# EAGLE board 8700 orig 45deg (EAGLE 7.4.0)
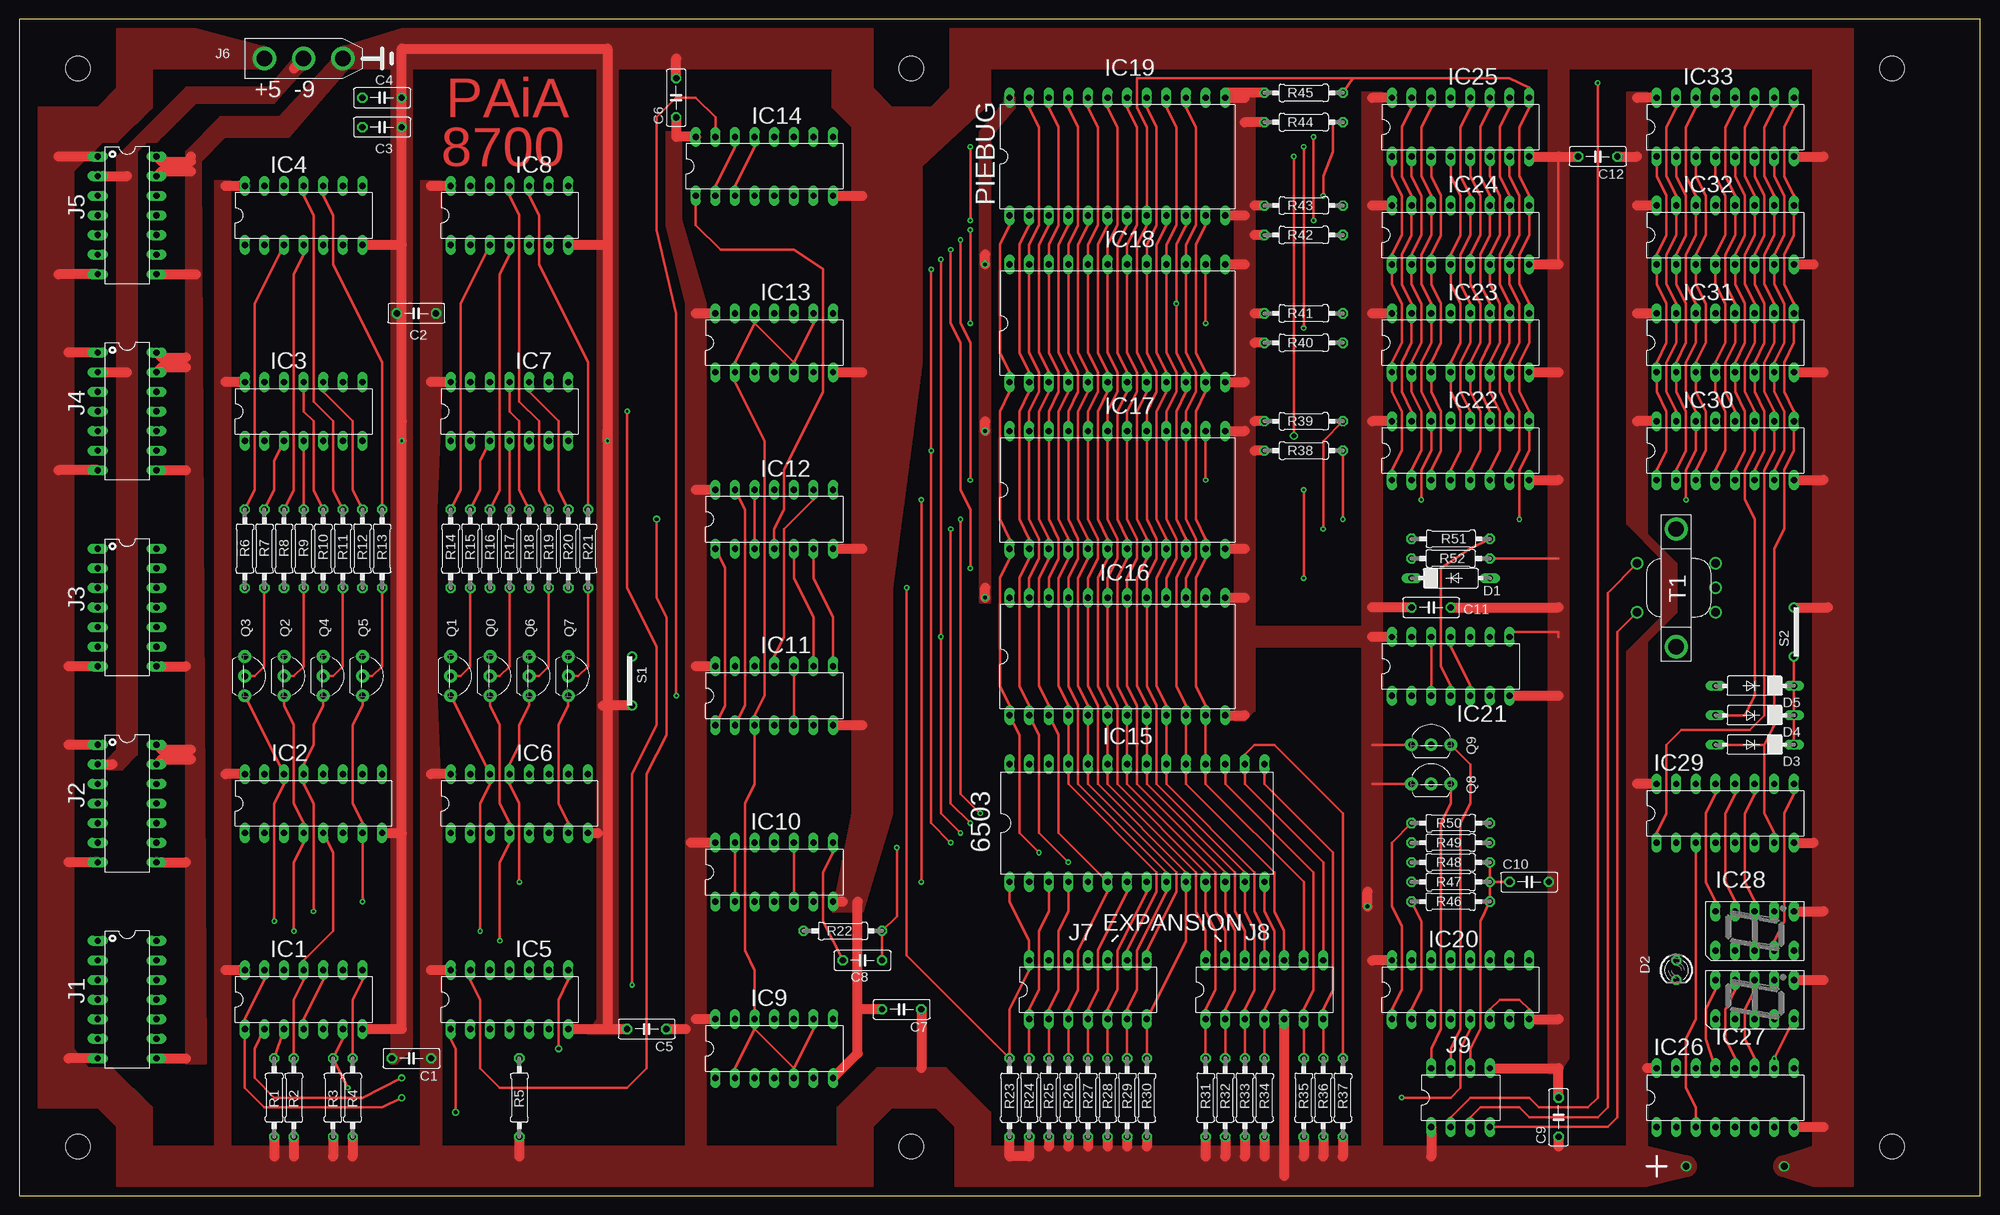
[diagram p2: board, top side]
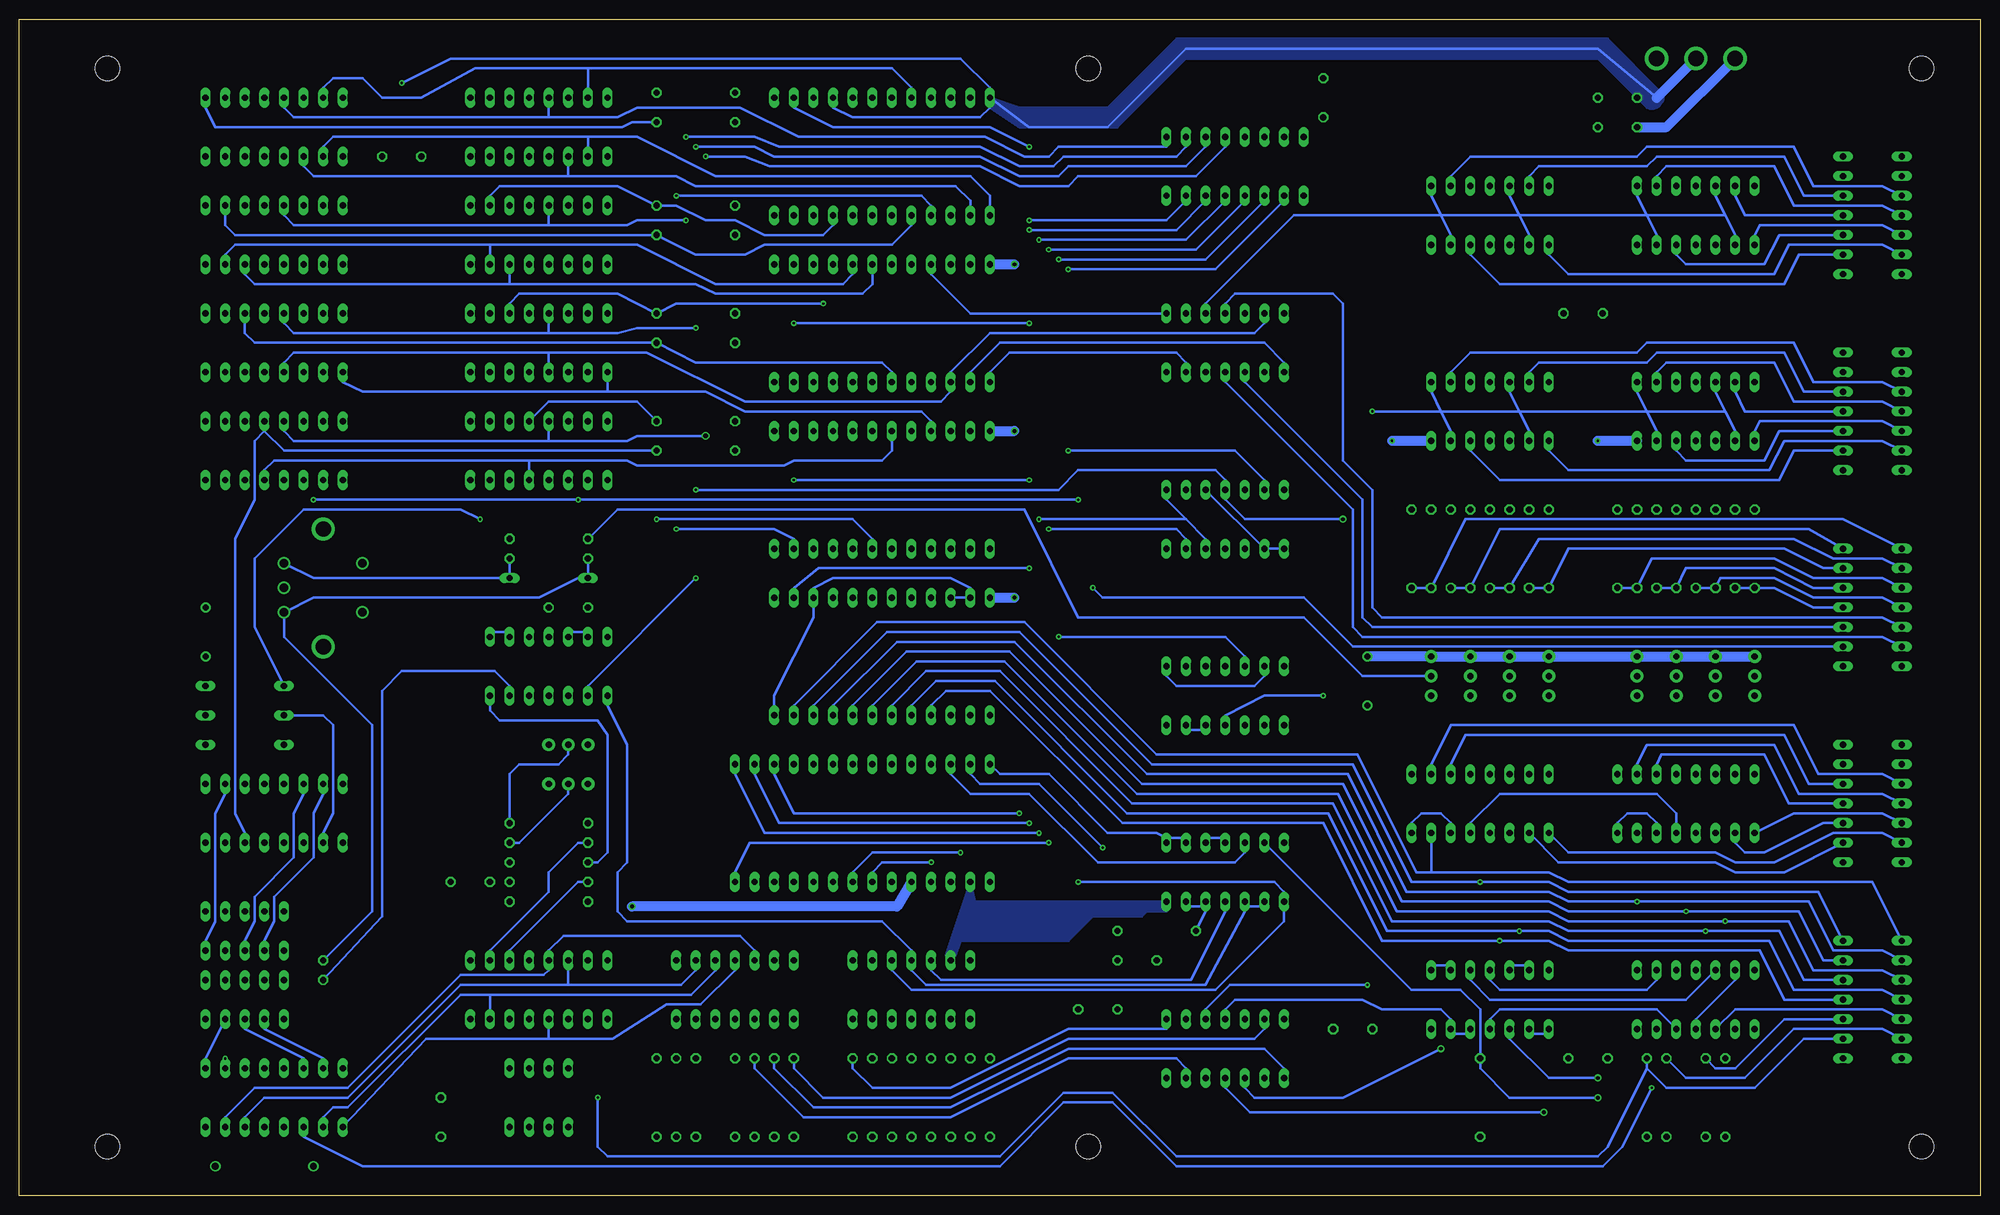
[diagram p3: board, bottom side, seen from below]

Size 254 x 152.4 mm. Coordinates in mm from the lower left corner, seen from the top.
Outline: 0,0 253.98,0 254,152.4 0,152.4 0,0
Copper layers (1*16): Top 0.035mm / dielectric 1.5mm / Bottom 0.035mm
Design rules "default": minimum track width 10mil, minimum drill 24mil, track to track 8mil, track to pad 8mil, pad to pad 8mil, via to via 8mil, smd to smd 8mil, copper to edge 40mil, drill to drill 8mil, minimum pad ring 10mil, minimum via ring 8mil, stop-mask expansion 4mil, vias tented up to drill 0mil, thermal gap 10mil
Holes 3.2 mm at 115.57,6.35 242.57,146.05 242.57,6.35 7.62,6.35 7.62,146.05 115.57,146.05

## Footprints (pad centres in the part's own frame; a part is rotated, then mirrored left to right if it is on the bottom)
C050-025X075 = drill 0.813 octagon: 1 -2.54,0; 2 2.54,0
DO07 = drill 0.813 long: A 5.08,0; C -5.08,0
LED3MM = drill 0.813 octagon: A -1.27,0; K 1.27,0
DIL14 = drill 0.813 long: 1 -7.62,-3.81; 2 -5.08,-3.81; 3 -2.54,-3.81; 4 0,-3.81; 5 2.54,-3.81; 6 5.08,-3.81; 7 7.62,-3.81; 8 7.62,3.81; 9 5.08,3.81; 10 2.54,3.81; 11 0,3.81; 12 -2.54,3.81; 13 -5.08,3.81; 14 -7.62,3.81
DIL16 = drill 0.813 long: 1 -8.89,-3.81; 2 -6.35,-3.81; 3 -3.81,-3.81; 4 -1.27,-3.81; 5 1.27,-3.81; 6 3.81,-3.81; 7 6.35,-3.81; 8 8.89,-3.81; 9 8.89,3.81; 10 6.35,3.81; 11 3.81,3.81; 12 1.27,3.81; 13 -1.27,3.81; 14 -3.81,3.81; 15 -6.35,3.81; 16 -8.89,3.81
DIL28-6 = drill 0.813 long: 1 -16.51,-7.62; 2 -13.97,-7.62; 3 -11.43,-7.62; 4 -8.89,-7.62; 5 -6.35,-7.62; 6 -3.81,-7.62; 7 -1.27,-7.62; 8 1.27,-7.62; 9 3.81,-7.62; 10 6.35,-7.62; 11 8.89,-7.62; 12 11.43,-7.62; 13 13.97,-7.62; 14 16.51,-7.62; 15 16.51,7.62; 16 13.97,7.62; 17 11.43,7.62; 18 8.89,7.62; 19 6.35,7.62; 20 3.81,7.62; 21 1.27,7.62; 22 -1.27,7.62; 23 -3.81,7.62; 24 -6.35,7.62; 25 -8.89,7.62; 26 -11.43,7.62; 27 -13.97,7.62; 28 -16.51,7.62
DIL24 = drill 0.813 long: 1 -13.97,-7.62; 2 -11.43,-7.62; 3 -8.89,-7.62; 4 -6.35,-7.62; 5 -3.81,-7.62; 6 -1.27,-7.62; 7 1.27,-7.62; 8 3.81,-7.62; 9 6.35,-7.62; 10 8.89,-7.62; 11 11.43,-7.62; 12 13.97,-7.62; 13 13.97,7.62; 14 11.43,7.62; 15 8.89,7.62; 16 6.35,7.62; 17 3.81,7.62; 18 1.27,7.62; 19 -1.27,7.62; 20 -3.81,7.62; 21 -6.35,7.62; 22 -8.89,7.62; 23 -11.43,7.62; 24 -13.97,7.62
HDSP-A = drill 0.813 long: 1 -2.54,5.08; 2 -2.54,2.54; 3 -2.54,0; 4 -2.54,-2.54; 5 -2.54,-5.08; 6 2.54,-5.08; 7 2.54,-2.54; 8 2.54,0; 9 2.54,2.54; 10 2.54,5.08
POWER = drill 2: P$1 -5.08,0; P$2 0,0; P$3 5.08,0
DIL08 = drill 0.813 long: 1 -3.81,-3.81; 2 -1.27,-3.81; 3 1.27,-3.81; 4 3.81,-3.81; 5 3.81,3.81; 6 1.27,3.81; 7 -1.27,3.81; 8 -3.81,3.81
TO92-EBC = drill 0.813 pad 1.676: B 0,-1.27; C 2.54,-1.27; E -2.54,-1.27
0207/10 = drill 0.813 octagon: 1 -5.08,0; 2 5.08,0
JUMPER = drill 0.8: 1 -3.175,0; 2 3.175,0
TRANSF = drill 1.1: P$1 -5.08,3.175; P$2 -5.08,-3.175; P$3 5.08,-3.175; P$4 5.08,0; P$5 5.08,3.175 | drill 2: P$6 0,7.62; P$7 0,-7.62

## Placement (x,y rotation side)
C1  [C050-025X075]  50.8,17.78 180 top
C2  [C050-025X075]  51.44,114.3 180 top
C3  [C050-025X075]  46.99,138.43 0 top
C4  [C050-025X075]  46.99,142.24 0 top
C5  [C050-025X075]  81.28,21.59 180 top
C6  [C050-025X075]  85.09,142.24 90 top
C7  [C050-025X075]  114.3,24.13 180 top
C8  33pf  [C050-025X075]  109.22,30.48 0 top
C9  [C050-025X075]  199.39,10.16 90 top
C10  [C050-025X075]  195.58,40.64 0 top
C11  [C050-025X075]  182.88,76.2 0 top
C12  [C050-025X075]  204.47,134.62 180 top
D1  [DO07]  185.42,80.01 0 top
D2  [LED3MM]  214.63,29.21 270 top
D3  1N914  [DO07]  224.79,58.42 180 top
D4  1N914  [DO07]  224.79,62.23 180 top
D5  1N914  [DO07]  224.79,66.04 180 top
IC1  74LS00  [DIL14]  36.83,25.4 0 top
IC2  4042  [DIL16]  38.1,50.8 0 top
IC3  4001  [DIL14]  36.83,101.6 0 top
IC4  4001  [DIL14]  36.83,127 0 top
IC5  4011  [DIL14]  63.5,25.4 0 top
IC6  4042  [DIL16]  64.77,50.8 0 top
IC7  4001  [DIL14]  63.5,101.6 0 top
IC8  4001  [DIL14]  63.5,127 0 top
IC9  4011  [DIL14]  97.79,19.05 0 top
IC10  74LS02  [DIL14]  97.79,41.91 0 top
IC11  4001  [DIL14]  97.79,64.77 0 top
IC12  4011  [DIL14]  97.79,87.63 0 top
IC13  4011  [DIL14]  97.79,110.49 0 top
IC14  4556  [DIL16]  96.52,133.35 0 top
IC15  6503  [DIL28-6]  144.78,48.26 0 top
IC16  1702  [DIL24]  142.24,69.85 0 top
IC17  1702  [DIL24]  142.24,91.44 0 top
IC18  1702  [DIL24]  142.24,113.03 0 top
IC19  1702  [DIL24]  142.24,134.62 0 top
IC20  4042  [DIL16]  186.69,26.67 0 top
IC21  4001  [DIL14]  185.42,68.58 0 top
IC22  2112  [DIL16]  186.69,96.52 0 top
IC23  2112  [DIL16]  186.69,110.49 0 top
IC24  2112  [DIL16]  186.69,124.46 0 top
IC25  2112  [DIL16]  186.69,138.43 0 top
IC26  9368  [DIL16]  220.98,12.7 0 top
IC27  HD-A101  [HDSP-A]  224.79,25.4 90 top
IC28  HD-A101  [HDSP-A]  224.79,34.29 90 top
IC29  9368  [DIL16]  220.98,49.53 0 top
IC30  2112  [DIL16]  220.98,96.52 0 top
IC31  2112  [DIL16]  220.98,110.49 0 top
IC32  2112  [DIL16]  220.98,124.46 0 top
IC33  2112  [DIL16]  220.98,138.43 0 top
J1  DATA BUS  [DIL14]  13.97,25.4 270 top
J2  OUTPUT  [DIL14]  13.97,50.8 270 top
J3  KEYBOARD  [DIL14]  13.97,76.2 270 top
J4  INPUT 1  [DIL14]  13.97,101.6 270 top
J5  INPUT 2  [DIL14]  13.97,127 270 top
J6  POWER  [POWER]  36.83,147.32 0 top
J7  EXPANSION0  [DIL14]  138.43,26.67 0 top
J8  EXPANSION1  [DIL14]  161.29,26.67 0 top
J9  Cassette  [DIL08]  186.69,12.7 0 top
Q0  [TO92-EBC]  62.23,67.31 270 top
Q1  [TO92-EBC]  57.15,67.31 270 top
Q2  [TO92-EBC]  35.56,67.31 270 top
Q3  [TO92-EBC]  30.48,67.31 270 top
Q4  [TO92-EBC]  40.64,67.31 270 top
Q5  [TO92-EBC]  45.72,67.31 270 top
Q6  [TO92-EBC]  67.31,67.31 270 top
Q7  [TO92-EBC]  72.39,67.31 270 top
Q8  [TO92-EBC]  182.88,54.61 0 top
Q9  [TO92-EBC]  182.88,59.69 0 top
R1  3.3k  [0207/10]  33.02,12.7 90 top
R2  3.3k  [0207/10]  35.56,12.7 90 top
R3  3.3k  [0207/10]  40.64,12.7 90 top
R4  3.3k  [0207/10]  43.18,12.7 90 top
R5  3.3k  [0207/10]  64.77,12.7 90 top
R6  27K  [0207/10]  29.21,83.82 270 top
R7  27K  [0207/10]  31.75,83.82 270 top
R8  27K  [0207/10]  34.29,83.82 270 top
R9  27K  [0207/10]  36.83,83.82 270 top
R10  27K  [0207/10]  39.37,83.82 270 top
R11  27K  [0207/10]  41.91,83.82 270 top
R12  27K  [0207/10]  44.45,83.82 270 top
R13  27K  [0207/10]  46.99,83.82 270 top
R14  27K  [0207/10]  55.88,83.82 270 top
R15  27K  [0207/10]  58.42,83.82 270 top
R16  27K  [0207/10]  60.96,83.82 270 top
R17  27K  [0207/10]  63.5,83.82 270 top
R18  27K  [0207/10]  66.04,83.82 270 top
R19  27K  [0207/10]  68.58,83.82 270 top
R20  27K  [0207/10]  71.12,83.82 270 top
R21  27K  [0207/10]  73.66,83.82 270 top
R22  2k  [0207/10]  106.68,34.29 180 top
R23  27k  [0207/10]  128.27,12.7 270 top
R24  27k  [0207/10]  130.81,12.7 270 top
R25  27k  [0207/10]  133.35,12.7 270 top
R26  10k  [0207/10]  135.89,12.7 270 top
R27  10k  [0207/10]  138.43,12.7 270 top
R28  10k  [0207/10]  140.97,12.7 270 top
R29  10k  [0207/10]  143.51,12.7 270 top
R30  10k  [0207/10]  146.05,12.7 270 top
R31  10k  [0207/10]  153.67,12.7 270 top
R32  10k  [0207/10]  156.21,12.7 270 top
R33  10k  [0207/10]  158.75,12.7 270 top
R34  10k  [0207/10]  161.29,12.7 270 top
R35  10k  [0207/10]  166.37,12.7 270 top
R36  10k  [0207/10]  168.91,12.7 270 top
R37  10k  [0207/10]  171.45,12.7 270 top
R38  10k  [0207/10]  166.37,96.52 180 top
R39  10k  [0207/10]  166.37,100.33 180 top
R40  10k  [0207/10]  166.37,110.49 180 top
R41  10k  [0207/10]  166.37,114.3 180 top
R42  10k  [0207/10]  166.37,124.46 180 top
R43  10k  [0207/10]  166.37,128.27 180 top
R44  10k  [0207/10]  166.37,139.06 180 top
R45  10k  [0207/10]  166.37,142.88 180 top
R46  100k  [0207/10]  185.42,38.1 0 top
R47  100k  [0207/10]  185.42,40.64 0 top
R48  1k  [0207/10]  185.42,43.18 0 top
R49  10k  [0207/10]  185.42,45.72 0 top
R50  10k  [0207/10]  185.42,48.26 0 top
R51  1k  [0207/10]  185.42,82.55 0 top
R52  27k  [0207/10]  185.42,85.09 180 top
S1  [JUMPER]  79.38,66.67 270 top
S2  [JUMPER]  229.87,73.03 90 top
T1  [TRANSF]  214.63,78.74 0 top

## Tracks (layer width: path | path; a pad name or v marks a point on that pad's centre or on a via)
+5V  (via drill 0.5, 0.9 pad 0.3)
  Top 0.305: IC19.15 151.13,140.97 152.4,138.43 152.4,125.73 151.13,123.19 IC18.15 151.13,109.22 152.4,106.68 152.4,104.14 151.13,101.6 IC17.15 151.13,87.63 152.4,85.09 152.4,82.55 151.13,80.01 IC16.15 | IC19.23 130.81,140.97 132.08,138.43 132.08,125.73 130.81,123.19 IC18.23 130.81,109.22 132.08,106.68 132.08,104.14 130.81,101.6 IC17.23 130.81,87.63 132.08,85.09 132.08,82.55 130.81,80.01 IC16.23 | IC19.22 133.35,140.97 134.62,138.43 134.62,125.73 133.35,123.19 IC18.22 133.35,109.22 134.62,106.68 134.62,104.14 133.35,101.6 IC17.22 133.35,87.63 134.62,85.09 134.62,82.55 133.35,80.01 IC16.22 | Q9.E 175.26,58.42 | Q8.E 175.26,53.34
  Top 1.27: IC4.14 26.67,130.81 | IC3.14 26.67,105.41 | IC2.16 26.67,54.61 | IC1.14 26.67,29.21 | IC8.14 53.34,130.81 | IC7.14 53.34,105.41 | IC6.16 53.34,54.61 | IC5.14 53.34,29.21 | IC9.14 87.63,22.86 | IC11.14 87.63,68.58 | IC12.14 87.63,91.44 | IC13.14 87.63,114.3 | IC10.14 87,45.72 | R1.1 33.02,5.08 | R2.1 35.56,5.08 | R3.1 40.64,5.08 | R4.1 43.18,5.08 | J1.7 6.35,17.78 | J2.7 6.35,43.18 | J2.1 6.35,58.42 | J3.7 6.35,68.58 | J5.1 5.08,134.62 | J4.7 5.08,93.98 | IC14.16 85.09,137.16 C6.1 | IC21.14 175.26,72.39 | IC17.12 158.75,83.82 | IC16.12 158.75,62.23 | IC18.12 158.75,105.41 | IC19.12 158.75,127 | IC22.16 175.26,100.33 | IC23.16 175.26,114.3 | IC24.16 175.26,128.27 | IC25.16 175.26,142.24 | IC33.16 209.55,142.24 | IC32.16 209.55,128.27 | IC31.16 209.55,114.3 | IC30.16 209.55,100.33 | IC20.16 175.26,30.48 | IC26.16 210.82,16.51 | IC29.16 209.55,53.34 | v174.62,37.47 174.62,39.37 | 158.75,142.24 IC19.13 156.21,142.88 R45.2 | IC18.13 158.75,120.65 | IC17.13 158.75,99.06 | IC16.13 158.75,77.47 | J5.7 5.08,119.38 | J4.1 6.35,109.22 | R5.1 64.77,5.08 | J8.5 163.83,2.54 | J9.1 182.88,5.08 | R37.2 171.45,5.08 | R36.2 168.91,5.08 | R35.2 166.37,5.08 | R34.2 161.29,5.08 | R33.2 158.75,5.08 | R32.2 156.21,5.08 | R31.2 153.67,5.08 | R30.2 146.05,6.35 | R29.2 143.51,6.35 | R28.2 140.97,6.35 | R27.2 138.43,6.35 | R44.2 158.75,139.06 | R43.2 160.02,128.27 | R42.2 160.02,124.46 | R41.2 160.02,114.3 | R40.2 160.02,110.49 | R39.2 160.02,100.33 | R38.2 160.02,96.52 | R26.2 135.89,6.35 | R25.2 133.35,6.35 | R24.2 130.81,5.08 128.27,5.08 R23.2 | C12.1 209.55,134.62 | C9.1 199.39,6.35 | C5.1 86.36,21.59 | C7.1 116.84,16.51 | C11.1 175.26,76.2
  Bottom 0.305: IC16.22 IC16.23 130.81,78.74 133.35,80.01 148.59,80.01 151.13,78.74 IC16.15 151.13,74.93 156.21,64.77 IC16.12
  Bottom 1.27: IC15.5 140.34,37.47 v174.62,37.47 | C3.1 40.64,138.43 J6.P$1
  other vias: 215.9,3.81
  pour Top: 25.4,131.44 25.4,3.81 27.3,3.81 27.3,131.44
  pour Top (no thermals): 52.07,131.44 52.07,5.08 54.61,5.08 54.61,49.53 53.98,65.41 53.98,88.9 54.61,104.14 54.61,131.44
  pour Top: 86.36,115.57 86.36,6.35 88.9,6.35 88.9,115.57 85.72,126.36 85.72,137.79 83.82,137.79 83.82,125.73
  pour Top (no thermals): 2.54,11.43 10.16,11.43 12.7,8.89 12.7,1.27 110.49,1.27 110.49,8.89 113.03,11.43 118.75,11.43 121.28,8.89 121.28,1.27 210.82,1.27 215.9,2.54 arc90 217.17,3.81 arc90 215.9,5.08 210.82,6.35 210.82,71.75 214.63,75.56 214.63,81.92 210.82,85.72 210.82,142.88 208.28,142.88 208.28,87 212.72,82.55 212.72,74.93 208.28,70.48 208.28,6.35 176.53,6.35 176.53,142.88 173.99,142.88 173.99,73.66 160.02,73.66 160.02,142.88 157.48,142.88 157.48,61.59 158.75,61.59 160.02,62.87 160.02,71.12 173.99,71.12 173.99,6.35 125.73,6.35 125.73,10.79 120.02,16.51 111.12,16.51 106.05,11.43 106.05,6.35 17.14,6.35 17.14,11.43 12.06,16.51 8.89,16.51 6.99,19.05 6.99,132.72 10.79,136.53 12.7,136.53 17.14,140.97 17.14,146.05 31.75,146.05 33.02,147.32 32.38,148.59 22.86,151.13 12.7,151.13 12.7,143.51 10.16,140.97 2.54,140.97
-9V  (via drill 0.3, 0.5)
  Top 0.305: J9.2 185.42,10.16 187.96,12.7 195.58,12.7 196.85,11.43 203.2,11.43 204.47,12.7 v204.47,144.15 | IC16.16 148.59,80.01 149.86,82.55 149.86,85.09 148.59,87.63 IC17.16 148.59,101.6 149.86,104.14 149.86,106.68 148.59,109.22 IC18.16 148.59,123.19 149.86,125.73 149.86,138.43 148.59,140.97 IC19.16
  Top 1.27: J5.2 13.97,132.08 | J2.2 12.06,55.88 | J6.P$2 35.56,146.05 | v125.09,120.65 125.09,121.92 | v125.09,99.06 125.09,100.33 | v125.09,77.47 125.09,78.74 | J4.2 13.97,106.68
  Bottom 0.305: 41.91,142.24 49.53,148.59 102.87,148.59 113.03,138.43 123.19,138.43 IC19.24 | v204.47,144.15 198.12,147.32 132.08,147.32 128.27,143.51 IC19.24 | IC19.16 148.59,140.97 146.05,139.7 129.54,139.7 128.27,140.97 IC19.24
  Bottom 1.27: IC18.24 v125.09,120.65 | IC17.24 v125.09,99.06 | IC16.24 v125.09,77.47 | J6.P$2 41.91,142.24
  pour Top (no thermals): 11.43,56.52 12.7,57.78 12.7,134.62 21.59,143.51 32.38,143.51 35.56,147.32 38.1,147.32 33.02,141.6 22.86,141.6 17.78,136.53 16.51,136.53 15.24,135.25 15.24,57.15 13.34,55.24 11.43,55.24
  pour Top (no thermals): 128.91,142.24 128.91,140.97 125.73,137.16 125.73,76.83 124.46,76.83 124.46,137.79 127.64,141.6 127.64,142.24
  pour Bottom (no thermals): 128.27,142.24 124.46,140.97 113.03,140.97 104.14,149.86 48.26,149.86 41.27,142.88 arc90 41.27,141.6 arc90 43.18,140.97 49.53,147.32 102.87,147.32 111.76,138.43 124.46,138.43 128.27,140.97
/CASS  (via drill 0.3)
  Top 0.305: IC1.8 44.45,27.94 43.18,25.4 R4.2 | v179.07,12.7 185.42,12.7 186.69,13.97 186.69,19.05 187.96,21.59 IC20.5
  Bottom 0.305: 43.18,16.51 40.64,13.97 29.21,13.97 22.86,20.32 J1.9 | R4.2 43.18,16.51 | 43.18,16.51 48.26,6.35 49.53,5.08 104.14,5.08 112.39,13.34 118.75,13.34 127,5.08 177.8,5.08 179.07,6.35 v179.07,12.7
/CS0
  Bottom 0.305: J3.5 12.7,74.93 77.47,74.93 78.74,76.2 78.74,91.44 82.55,95.25 82.55,115.57 83.82,116.84 96.52,116.84 97.79,115.57 IC13.11
/CS1
  Bottom 0.305: IC13.3 95.25,105.41 80.01,90.17 80.01,74.93 78.74,73.66 J3.10
/CS2
  Bottom 0.305: IC13.4 97.79,105.41 81.28,88.9 81.28,73.66 80.01,72.39 12.7,72.39 J3.6
/CS3
  Bottom 0.305: IC13.10 100.33,115.57 88.9,127 69.85,127 | IC4.12 34.29,129.54 33.02,127 | 33.02,127 31.75,124.46 IC4.2 | IC4.8 44.45,129.54 43.18,127 | 43.18,127 41.91,124.46 IC4.6 | IC8.2 58.42,124.46 59.69,127 | IC8.12 60.96,129.54 59.69,127 | IC8.6 68.58,124.46 69.85,127 | 69.85,127 71.12,129.54 IC8.8 | 33.02,127 43.18,127 | 43.18,127 59.69,127 | 59.69,127 69.85,127
/CS4  (via drill 0.3)
  Top 0.305: v78.74,101.6 78.74,78.74 82.55,71.12 82.55,60.96 79.38,54.61 v79.38,27.3
  Bottom 0.305: IC7.6 68.58,99.06 69.85,101.6 | IC7.12 60.96,104.14 59.69,101.6 | 59.69,101.6 58.42,99.06 IC7.2 | IC3.8 44.45,104.14 43.18,101.6 | 43.18,101.6 41.91,99.06 IC3.6 | 33.02,101.6 31.75,99.06 IC3.2 | IC3.12 34.29,104.14 33.02,101.6 | 43.18,101.6 59.69,101.6 | 59.69,101.6 69.85,101.6 | 69.85,101.6 v78.74,101.6 | v79.38,27.3 97.16,27.3 100.33,24.13 IC9.10 | 33.02,101.6 43.18,101.6 | IC7.8 71.12,104.14 69.85,101.6
/CS5
  Bottom 0.305: IC5.5 66.04,20.95 68.58,20.95 IC5.6 68.58,22.86 69.85,24.13 77.47,24.13 80.01,25.4 96.52,25.4 97.79,24.13 IC9.11
/CS6  (via drill 0.5)
  Top 0.305: IC5.8 71.12,27.94 69.85,25.4 v69.85,19.05
  Bottom 0.305: IC5.9 68.58,29.84 71.12,29.84 IC5.8 | v69.85,19.05 82.55,12.7 93.98,12.7 95.25,13.97 IC9.3
/CS7  (via drill 0.5)
  Top 0.305: IC5.1 55.88,20.32 56.52,19.05 v56.52,10.79
  Bottom 0.305: IC5.2 58.42,20.95 55.88,20.95 IC5.1 | v56.52,10.79 94.61,10.79 97.79,13.97 IC9.4
/CS9  (via drill 0.3, 0.5)
  Top 0.305: IC5.13 58.42,27.94 59.69,25.4 59.69,16.51 62.23,13.97 78.74,13.97 81.28,16.51 81.28,54.61 83.82,59.69 83.82,74.93 82.55,77.47 v82.55,87.63 | v166.37,91.44 v166.37,80.01
  Bottom 0.305: IC5.12 60.96,29.84 58.42,29.84 IC5.13 | v82.55,87.63 95.25,87.63 97.79,90.17 IC12.11 97.79,92.71 99.06,93.98 116.84,93.98 119.38,91.44 v166.37,91.44 | v166.37,80.01 180.34,66.04 IC21.2
/DISPLAY  (via drill 0.3)
  Top 0.305: IC1.6 41.91,20.32 R3.2 v42.55,13.97 | IC29.3 217.17,22.86 215.9,20.32 215.9,13.97 217.17,11.43 IC26.3
  Bottom 0.305: R3.2 38.1,15.24 30.48,15.24 24.13,21.59 12.7,21.59 J1.6 | v42.55,13.97 46.35,6.35 48.9,3.81 104.14,3.81 112.39,12.06 118.75,12.06 127,3.81 209.55,3.81 217.17,7.62 IC26.3
/IRQ
  Top 0.305: IC15.3 133.35,36.83 132.08,34.29 132.08,26.67 130.81,24.13 J7.1 R24.1
/OUTPORT
  Top 0.305: R2.2 35.56,25.4 36.83,27.94 IC1.11 36.83,30.48 40.64,34.29 40.64,44.45 IC2.5
  Bottom 0.305: R2.2 34.29,16.51 31.75,16.51 25.4,22.86 J1.10 | IC2.5 39.37,49.53 41.91,52.07 62.23,52.07 66.04,48.26 IC6.5
/RST  (via drill 0.3)
  Top 0.305: v114.94,78.74 114.94,31.11 R23.1 128.27,24.13 130.81,29.21 J7.14 130.81,33.02 128.27,38.1 IC15.1
  Bottom 0.305: J3.9 81.28,71.12 87.63,77.47 113.67,77.47 v114.94,78.74
/STROBE
  Top 0.305: R1.2 IC1.3
  Bottom 0.305: IC1.3 31.75,24.13 12.7,24.13 J1.5
A0
  Top 0.305: IC19.3 133.35,125.73 132.08,123.19 132.08,109.22 133.35,106.68 IC18.3 133.35,104.14 132.08,101.6 132.08,87.63 133.35,85.09 IC17.3 133.35,82.55 132.08,80.01 132.08,66.04 133.35,63.5 IC16.3 134.62,59.69 134.62,46.99 IC15.6 140.97,39.37 137.16,31.75 137.16,26.67 135.89,24.13 J7.3 R26.1 | IC25.4 185.42,132.08 186.69,129.54 186.69,124.46 185.42,121.92 IC24.4 185.42,118.11 186.69,115.57 186.69,110.49 185.42,107.95 IC23.4 185.42,104.14 186.69,101.6 186.69,96.52 185.42,93.98 IC22.4 | IC30.4 219.71,93.98 220.98,96.52 220.98,101.6 219.71,104.14 IC31.4 219.71,107.95 220.98,110.49 220.98,115.57 219.71,118.11 IC32.4 219.71,121.92 220.98,124.46 220.98,129.54 219.71,132.08 IC33.4
  Bottom 0.305: IC13.13 92.71,113.03 93.98,111.76 128.27,111.76 133.35,106.68 IC18.3 133.35,104.14 134.62,102.87 160.02,102.87 172.72,109.22 185.42,109.22 | IC31.4 219.71,107.95 218.44,109.22 185.42,109.22 | IC23.4 185.42,109.22
A1  (via drill 0.3)
  Top 0.305: v135.89,43.18 132.08,46.99 132.08,59.69 IC16.2 130.81,63.5 129.54,66.04 129.54,80.01 130.81,82.55 IC17.2 130.81,85.09 129.54,87.63 129.54,101.6 130.81,104.14 IC18.2 130.81,106.68 129.54,109.22 129.54,123.19 130.81,125.73 IC19.2 | IC15.7 143.51,39.37 139.7,31.75 139.7,26.67 138.43,24.13 J7.4 R27.1 | IC22.3 182.88,93.98 184.15,96.52 184.15,101.6 182.88,104.14 IC23.3 182.88,107.95 184.15,110.49 184.15,115.57 182.88,118.11 IC24.3 182.88,121.92 184.15,124.46 184.15,129.54 182.88,132.08 IC25.3 | IC33.3 217.17,132.08 218.44,129.54 218.44,124.46 217.17,121.92 IC32.3 217.17,118.11 218.44,115.57 218.44,110.49 217.17,107.95 IC31.3 217.17,104.14 218.44,101.6 218.44,96.52 217.17,93.98 IC30.3
  Bottom 0.305: v135.89,43.18 142.24,43.18 143.51,41.91 IC15.7 | IC13.1 90.17,107.95 92.71,110.49 127,110.49 130.81,106.68 IC18.2 | IC19.2 130.81,128.91 132.72,130.81 166.37,130.81 168.91,132.08 182.88,132.08 | 182.88,132.08 215.9,132.08 217.17,133.35 IC33.3 | 182.88,132.08 IC25.3
A2  (via drill 0.3)
  Top 0.305: v132.08,44.45 129.54,46.99 129.54,59.69 IC16.1 128.27,63.5 127,66.04 127,80.01 128.27,82.55 IC17.1 128.27,85.09 127,87.63 127,101.6 128.27,104.14 IC18.1 128.27,106.68 127,109.22 127,123.19 128.27,125.73 IC19.1 | IC15.8 146.05,39.37 142.24,31.75 142.24,26.67 140.97,24.13 J7.5 R28.1 | IC22.2 180.34,93.98 181.61,96.52 181.61,101.6 180.34,104.14 IC23.2 180.34,107.95 181.61,110.49 181.61,115.57 180.34,118.11 IC24.2 180.34,121.92 181.61,124.46 181.61,129.54 180.34,132.08 IC25.2 | IC30.2 214.63,93.98 215.9,96.52 215.9,101.6 214.63,104.14 IC31.2 214.63,107.95 215.9,110.49 215.9,115.57 214.63,118.11 IC32.2 214.63,121.92 215.9,124.46 215.9,129.54 214.63,132.08 IC33.2
  Bottom 0.305: v132.08,44.45 143.51,44.45 146.05,41.91 IC15.8 | IC13.6 102.87,107.95 104.14,109.22 125.73,109.22 128.27,106.68 IC18.1 | IC19.1 128.27,129.54 130.81,132.08 163.83,132.08 173.99,137.16 180.34,137.16 | 180.34,137.16 213.36,137.16 214.63,135.89 IC33.2 | IC25.2 180.34,137.16
A3
  Top 0.305: IC19.21 135.89,140.97 137.16,138.43 137.16,125.73 135.89,123.19 IC18.21 135.89,109.22 137.16,106.68 137.16,104.14 135.89,101.6 IC17.21 135.89,87.63 137.16,85.09 137.16,82.55 135.89,80.01 IC16.21 135.89,66.04 137.16,63.5 137.16,53.34 148.59,41.91 IC15.9 148.59,39.37 144.78,31.75 144.78,26.67 143.51,24.13 J7.6 R29.1 | IC25.1 177.8,132.08 179.07,129.54 179.07,124.46 177.8,121.92 IC24.1 177.8,118.11 179.07,115.57 179.07,110.49 177.8,107.95 IC23.1 177.8,104.14 179.07,101.6 179.07,96.52 177.8,93.98 IC22.1 | IC33.1 212.09,132.08 213.36,129.54 213.36,124.46 212.09,121.92 IC32.1 212.09,118.11 213.36,115.57 213.36,110.49 212.09,107.95 IC31.1 212.09,104.14 213.36,101.6 213.36,96.52 212.09,93.98 IC30.1
  Bottom 0.305: IC13.8 130.81,114.3 135.89,119.38 IC18.21 | IC31.1 212.09,105.41 209.55,104.14 177.8,104.14 | IC17.21 135.89,100.33 137.16,101.6 160.02,101.6 165.1,104.14 177.8,104.14 | 177.8,104.14 IC23.1
A4
  Top 0.305: IC19.20 138.43,140.97 139.7,138.43 139.7,125.73 138.43,123.19 IC18.20 138.43,109.22 139.7,106.68 139.7,104.14 138.43,101.6 IC17.20 138.43,87.63 139.7,85.09 139.7,82.55 138.43,80.01 IC16.20 138.43,66.04 139.7,63.5 139.7,53.34 151.13,41.91 IC15.10 151.13,33.02 J7.7 R30.1 | IC22.15 180.34,101.6 179.07,104.14 179.07,107.95 180.34,110.49 IC23.15 180.34,115.57 179.07,118.11 179.07,121.92 180.34,124.46 IC24.15 180.34,129.54 179.07,132.08 179.07,138.43 180.34,140.97 IC25.15 | IC33.15 214.63,140.97 213.36,138.43 213.36,132.08 214.63,129.54 IC32.15 214.63,124.46 213.36,121.92 213.36,118.11 214.63,115.57 IC31.15 214.63,110.49 213.36,107.95 213.36,104.14 214.63,101.6 IC30.15
  Bottom 0.305: IC9.8 105.41,21.59 118.11,21.59 133.35,13.97 143.51,13.97 146.05,16.51 R30.1 | IC25.15 180.34,146.05 | 180.34,146.05 194.94,146.05 201.93,142.24 207.01,142.24 209.55,144.78 213.36,144.78 214.63,143.51 IC33.15 | 180.34,146.05 140.97,146.05 138.43,143.51 IC19.20
A5
  Top 0.305: IC19.19 140.97,140.97 142.24,138.43 142.24,125.73 140.97,123.19 IC18.19 140.97,109.22 142.24,106.68 142.24,104.14 140.97,101.6 IC17.19 140.97,87.63 142.24,85.09 142.24,82.55 140.97,80.01 IC16.19 140.97,66.04 142.24,63.5 142.24,53.34 153.67,41.91 IC15.11 153.67,36.83 154.94,34.29 154.94,26.67 153.67,24.13 J8.1 R31.1 | IC25.5 187.96,132.08 189.23,129.54 189.23,124.46 187.96,121.92 IC24.5 187.96,118.11 189.23,115.57 189.23,110.49 187.96,107.95 IC23.5 187.96,104.14 189.23,101.6 189.23,96.52 187.96,93.98 IC22.5 | IC33.5 222.25,132.08 223.52,129.54 223.52,124.46 222.25,121.92 IC32.5 222.25,118.11 223.52,115.57 223.52,110.49 222.25,107.95 IC31.5 222.25,104.14 223.52,101.6 223.52,96.52 222.25,93.98 IC30.5
  Bottom 0.305: IC9.13 92.71,21.59 93.98,20.32 118.11,20.32 133.35,12.7 149.86,12.7 153.67,16.51 R31.1 | IC30.5 222.25,93.98 220.98,95.25 187.96,95.25 | IC22.5 187.96,95.25 | 187.96,95.25 175.26,95.25 173.99,94.61 154.94,94.61 153.67,95.25 142.24,95.25 140.97,96.52 IC17.19
A6
  Top 0.305: IC19.18 143.51,140.97 144.78,138.43 144.78,125.73 143.51,123.19 IC18.18 143.51,109.22 144.78,106.68 144.78,104.14 143.51,101.6 IC17.18 143.51,87.63 144.78,85.09 144.78,82.55 143.51,80.01 IC16.18 143.51,66.04 144.78,63.5 144.78,53.34 156.21,41.91 IC15.12 156.21,36.83 157.48,34.29 157.48,26.67 156.21,24.13 J8.2 R32.1 | IC25.6 190.5,132.08 191.77,129.54 191.77,124.46 190.5,121.92 IC24.6 190.5,118.11 191.77,115.57 191.77,110.49 190.5,107.95 IC23.6 190.5,104.14 191.77,101.6 191.77,96.52 190.5,93.98 IC22.6 | IC33.6 224.79,132.08 226.06,129.54 226.06,124.46 224.79,121.92 IC32.6 224.79,118.11 226.06,115.57 226.06,110.49 224.79,107.95 IC31.6 224.79,104.14 226.06,101.6 226.06,96.52 224.79,93.98 IC30.6
  Bottom 0.305: IC9.1 90.17,16.51 92.71,19.05 118.11,19.05 133.35,11.43 151.13,11.43 156.21,16.51 R32.1 | IC32.6 224.79,119.38 223.52,118.11 190.5,118.11 | 190.5,118.11 166.37,118.11 163.83,116.84 144.78,116.84 143.51,118.11 IC18.18 | IC24.6 190.5,118.11
A7
  Top 0.305: IC19.17 146.05,140.97 147.32,138.43 147.32,125.73 146.05,123.19 IC18.17 146.05,109.22 147.32,106.68 147.32,104.14 146.05,101.6 IC17.17 146.05,87.63 147.32,85.09 147.32,82.55 146.05,80.01 IC16.17 146.05,66.04 147.32,63.5 147.32,53.34 158.75,41.91 IC15.13 158.75,36.83 160.02,34.29 160.02,26.67 158.75,24.13 J8.3 R33.1 | IC25.7 193.04,132.08 194.31,129.54 194.31,124.46 193.04,121.92 IC24.7 193.04,118.11 194.31,115.57 194.31,110.49 193.04,107.95 IC23.7 193.04,104.14 194.31,101.6 194.31,96.52 193.04,93.98 IC22.7 | IC30.7 227.33,93.98 228.6,96.52 228.6,101.6 227.33,104.14 IC31.7 227.33,107.95 228.6,110.49 228.6,115.57 227.33,118.11 IC32.7 227.33,121.92 228.6,124.46 228.6,129.54 227.33,132.08 IC33.7
  Bottom 0.305: IC9.6 102.87,16.51 104.14,17.78 118.11,17.78 133.35,10.16 152.4,10.16 158.75,16.51 R33.1 | IC32.7 227.33,121.92 226.06,123.19 193.04,123.19 | 193.04,123.19 173.99,123.19 163.83,118.11 147.32,118.11 146.05,119.38 IC18.17 | 193.04,123.19 IC24.7
A8  (via drill 0.3)
  Top 0.305: IC14.14 92.71,135.89 90.17,130.81 IC14.2 | v118.11,120.02 v118.11,96.52 118.11,48.26 v120.65,45.72 | IC15.14 161.29,36.83 162.56,34.29 162.56,26.67 161.29,24.13 J8.4 R34.1 | IC11.2 93.98,63.5 93.98,88.9 IC12.13
  Bottom 0.305: IC14.2 90.17,128.91 99.06,120.02 v118.11,120.02 | v120.65,45.72 159.38,45.72 161.29,41.91 IC15.14 | v118.11,96.52 96.52,96.52 92.71,92.71 IC12.13
A9  (via drill 0.3)
  Top 0.305: IC14.3 92.71,130.81 95.25,135.89 IC14.13 | v119.38,121.28 v119.38,72.39 119.38,49.53 v121.92,46.99 | IC15.15 161.29,53.34 170.18,44.45 170.18,26.67 168.91,24.13 J8.7 R36.1
  Bottom 0.305: IC14.3 92.71,128.91 100.33,121.28 v119.38,121.28 | v121.92,46.99 157.48,46.99 161.29,54.61 IC15.15 | IC11.12 95.25,69.85 97.79,72.39 v119.38,72.39
A10  (via drill 0.3)
  Top 0.305: J8.8 168.91,43.18 158.75,53.34 IC15.16 158.75,57.15 160.02,58.42 162.56,58.42 171.45,49.53 R37.1 | v123.19,48.26 120.65,50.8 v120.65,86.36 | IC12.6 102.87,80.01 105.41,74.93 IC11.8
  Bottom 0.305: IC15.16 158.75,54.61 155.57,48.26 v123.19,48.26 | v120.65,86.36 104.14,86.36 102.87,85.09 IC12.6 | IC11.13 92.71,67.31 93.98,66.04 104.14,66.04 105.41,67.31 IC11.8
A11  (via drill 0.3)
  Top 0.305: IC15.17 156.21,53.34 167.64,41.91 167.64,26.67 166.37,24.13 J8.6 R35.1 | v124.46,49.53 121.92,52.07 v121.92,87.63 | IC12.5 100.33,80.01 102.87,74.93 IC11.9
  Bottom 0.305: IC12.8 105.41,90.17 102.87,87.63 | 102.87,87.63 100.33,85.09 IC12.5 | IC15.17 156.21,54.61 153.67,49.53 v124.46,49.53 | v121.92,87.63 102.87,87.63
D0  (via drill 0.3)
  Top 0.305: Q0.C 60.96,63.5 62.23,60.96 62.23,50.8 63.5,48.26 IC6.4 63.5,45.72 62.23,43.18 v62.23,33.02 | J7.9 143.51,31.75 147.32,39.37 147.32,41.91 135.89,53.34 IC15.25 IC16.4 135.89,63.5 134.62,66.04 134.62,80.01 135.89,82.55 IC17.4 135.89,85.09 134.62,87.63 134.62,101.6 135.89,104.14 IC18.4 135.89,106.68 134.62,109.22 134.62,123.19 135.89,125.73 IC19.4 | IC29.7 227.33,46.99 226.06,49.53 226.06,58.42 | 226.06,58.42 227.33,60.96 227.33,83.82 228.6,86.36 228.6,93.98 229.87,96.52 IC30.9 229.87,101.6 228.6,104.14 228.6,107.95 229.87,110.49 IC31.9 229.87,115.57 228.6,118.11 228.6,121.92 229.87,124.46 IC32.9 229.87,129.54 228.6,132.08 228.6,138.43 229.87,140.97 IC33.9 | D3.A 226.06,58.42 | v168.91,129.54 168.91,132.08 170.18,135.25 170.18,139.06 R44.1
  Bottom 0.305: J1.11 25.4,25.4 28.57,31.75 53.34,31.75 55.88,33.02 v62.23,33.02 77.47,33.02 85.09,48.26 111.12,48.26 128.27,65.41 133.99,65.41 135.89,63.5 IC16.4 | IC19.4 135.89,128.27 137.16,129.54 v168.91,129.54 | IC33.9 229.87,140.97 228.6,138.43 175.9,138.43 174.62,139.06 R44.1
D1  (via drill 0.3)
  Top 0.305: Q1.C IC6.14 60.96,53.34 59.69,50.8 v59.69,34.29 | J7.8 146.05,31.75 149.86,39.37 149.86,41.91 138.43,53.34 IC15.24 IC16.5 138.43,63.5 137.16,66.04 137.16,80.01 138.43,82.55 IC17.5 138.43,85.09 137.16,87.63 137.16,101.6 138.43,104.14 IC18.5 138.43,106.68 137.16,109.22 137.16,123.19 138.43,125.73 IC19.5 | IC29.1 212.09,46.99 213.36,49.53 213.36,58.42 215.26,60.33 224.16,60.33 226.06,62.23 226.06,93.98 227.33,96.52 IC30.10 227.33,101.6 226.06,104.14 226.06,107.95 227.33,110.49 IC31.10 227.33,115.57 226.06,118.11 226.06,121.92 227.33,124.46 IC32.10 227.33,129.54 226.06,132.08 226.06,138.43 227.33,140.97 IC33.10
  Bottom 0.305: J1.4 12.7,26.67 24.13,26.67 27.3,33.02 53.34,33.02 55.88,34.29 v59.69,34.29 76.83,34.29 84.45,49.53 110.49,49.53 127.64,66.67 135.25,66.67 138.43,63.5 IC16.5 | IC19.5 138.43,125.73 140.97,123.19 157.48,123.19 160.02,121.92 166.37,121.92 R42.1 226.06,124.46 227.33,125.73 IC32.10
D2  (via drill 0.3)
  Top 0.305: Q2.C 34.29,63.5 35.56,60.96 35.56,50.8 36.83,48.26 IC2.4 36.83,45.72 35.56,43.18 v35.56,34.29 | IC19.6 140.97,125.73 139.7,123.19 139.7,109.22 140.97,106.68 IC18.6 140.97,104.14 139.7,101.6 139.7,87.63 140.97,85.09 IC17.6 140.97,82.55 139.7,80.01 139.7,66.04 140.97,63.5 IC16.6 IC15.23 140.97,53.34 152.4,41.91 152.4,36.83 153.67,34.29 J8.14 | D4.A 223.52,62.23 224.79,64.77 224.79,87.63 223.52,90.17 223.52,93.98 224.79,96.52 IC30.11 224.79,101.6 223.52,104.14 223.52,107.95 224.79,110.49 IC31.11 224.79,115.57 223.52,118.11 223.52,121.92 224.79,124.46 IC32.11 224.79,129.54 223.52,132.08 223.52,138.43 224.79,140.97 IC33.11
  Bottom 0.305: J1.12 22.86,27.94 26.04,34.29 v35.56,34.29 53.34,34.29 55.88,35.56 76.2,35.56 83.82,50.8 109.86,50.8 127,67.94 136.53,67.94 140.97,63.5 IC16.6 | D4.A 214.63,62.23 213.36,60.96 213.36,49.53 214.63,46.99 IC29.2 | IC18.6 140.97,106.68 142.24,107.95 166.37,107.95 R40.1 223.52,110.49 224.79,111.76 IC31.11
D3  (via drill 0.3, 0.3 pad 0.3)
  Top 0.305: Q3.C IC2.14 34.29,53.34 33.02,50.8 v33.02,35.56 | IC19.7 143.51,125.73 142.24,123.19 142.24,109.22 143.51,106.68 IC18.7 143.51,104.14 142.24,101.6 142.24,87.63 143.51,85.09 IC17.7 143.51,82.55 142.24,80.01 142.24,66.04 143.51,63.5 IC16.7 IC15.22 143.51,53.34 154.94,41.91 154.94,36.83 156.21,34.29 J8.13 | IC33.12 222.25,140.97 220.98,138.43 220.98,132.08 222.25,129.54 IC32.12 222.25,124.46 220.98,121.92 220.98,118.11 222.25,115.57 IC31.12 222.25,110.49 220.98,107.95 220.98,104.14 222.25,101.6 IC30.12 | R38.1 v171.45,87.63
  Bottom 0.305: J1.3 12.7,29.21 21.59,29.21 24.77,35.56 v33.02,35.56 53.34,35.56 55.88,36.83 75.56,36.83 83.19,52.07 109.22,52.07 126.36,69.22 137.79,69.22 143.51,63.5 IC16.7 | IC30.12 222.25,99.06 | 222.25,99.06 219.71,96.52 R38.1 | v171.45,87.63 146.05,87.63 143.51,85.09 IC17.7 | IC29.6 224.79,46.99 226.06,49.53 226.06,85.09 223.52,90.17 223.52,97.79 222.25,99.06
D4  (via drill 0.3)
  Top 0.305: Q4.C 39.37,63.5 38.1,60.96 38.1,58.42 36.83,55.88 IC2.13 36.83,53.34 38.1,50.8 v38.1,36.83 | 172.72,144.78 193.04,144.78 195.58,143.51 IC25.9 195.58,140.97 194.31,138.43 194.31,132.08 195.58,129.54 IC24.9 195.58,124.46 194.31,121.92 194.31,118.11 195.58,115.57 IC23.9 195.58,110.49 194.31,107.95 194.31,104.14 195.58,101.6 IC22.9 195.58,96.52 194.31,93.98 v194.31,87.63 | 172.72,144.78 144.78,144.78 144.78,140.97 146.05,138.43 IC19.8 146.05,125.73 144.78,123.19 144.78,109.22 146.05,106.68 IC18.8 146.05,104.14 144.78,101.6 144.78,87.63 146.05,85.09 IC17.8 146.05,82.55 144.78,80.01 144.78,66.04 146.05,63.5 IC16.8 IC15.21 146.05,53.34 157.48,41.91 157.48,36.83 158.75,34.29 J8.12 | R45.1 172.72,144.78
  Bottom 0.305: J1.13 20.32,30.48 23.5,36.83 v38.1,36.83 53.34,36.83 55.88,38.1 74.93,38.1 82.55,53.34 108.58,53.34 125.73,70.48 139.06,70.48 146.05,63.5 IC16.8 | IC26.7 227.33,10.16 223.52,13.97 211.46,13.97 196.85,28.57 186.06,28.57 185.42,29.21 IC20.13 185.42,31.75 183.51,33.66 160.66,33.66 158.75,31.75 J8.12 | D5.A 223.52,73.66 223.52,82.55 217.17,88.9 196.85,88.9 v194.31,87.63
D5  (via drill 0.3)
  Top 0.305: Q5.C 44.45,63.5 43.18,60.96 43.18,50.8 44.45,48.26 IC2.7 v44.45,38.1 | IC19.9 148.59,125.73 147.32,123.19 147.32,109.22 148.59,106.68 IC18.9 148.59,104.14 147.32,101.6 147.32,87.63 148.59,85.09 IC17.9 148.59,82.55 147.32,80.01 147.32,66.04 148.59,63.5 IC16.9 IC15.20 148.59,53.34 160.02,41.91 160.02,36.83 161.29,34.29 J8.11 | IC25.10 193.04,140.97 191.77,138.43 191.77,132.08 193.04,129.54 IC24.10 193.04,124.46 191.77,121.92 191.77,118.11 193.04,115.57 IC23.10 193.04,110.49 191.77,107.95 191.77,104.14 193.04,101.6 IC22.10
  Bottom 0.305: J1.2 12.7,31.75 19.05,31.75 22.23,38.1 v44.45,38.1 53.34,38.1 55.88,39.37 74.3,39.37 81.92,54.61 107.95,54.61 125.09,71.75 140.34,71.75 148.59,63.5 IC16.9 | IC20.4 185.42,20.32 | 185.42,20.32 201.29,20.32 IC26.1 | J8.11 161.29,29.21 165.74,24.77 170.18,24.77 177.16,20.32 185.42,20.32 | IC19.9 148.59,125.73 149.86,124.46 157.48,124.46 161.29,126.36 165.1,126.36 168.91,128.27 R43.1 176.53,130.81 191.77,130.81 193.04,129.54 IC24.10
D6  (via drill 0.3, 0.3 pad 0.3)
  Top 0.305: Q6.C 66.04,63.5 64.77,60.96 64.77,58.42 63.5,55.88 IC6.13 63.5,53.34 64.77,50.8 v64.77,40.64 | IC19.10 151.13,125.73 149.86,123.19 v149.86,115.57 149.86,109.22 151.13,106.68 IC18.10 151.13,104.14 149.86,101.6 149.86,87.63 151.13,85.09 IC17.10 151.13,82.55 149.86,80.01 149.86,66.04 151.13,63.5 IC16.10 IC15.19 151.13,53.34 162.56,41.91 162.56,36.83 163.83,34.29 J8.10 | IC25.11 190.5,140.97 189.23,138.43 189.23,132.08 190.5,129.54 IC24.11 190.5,124.46 189.23,121.92 189.23,118.11 190.5,115.57 IC23.11 190.5,110.49 189.23,107.95 189.23,104.14 190.5,101.6 IC22.11
  Bottom 0.305: J1.14 20.95,39.37 53.34,39.37 55.88,40.64 v64.77,40.64 73.66,40.64 81.28,55.88 107.31,55.88 124.46,73.03 141.6,73.03 151.13,63.5 IC16.10 | IC20.7 193.04,26.04 | 193.04,26.04 196.85,26.04 211.46,11.43 213.36,11.43 214.63,10.16 IC26.2 | J8.10 163.83,29.21 167,26.04 193.04,26.04 | v149.86,115.57 168.91,115.57 R41.1 176.53,116.84 189.23,116.84 190.5,115.57 IC23.11
D7  (via drill 0.3 pad 0.3)
  Top 0.305: IC19.11 153.67,125.73 152.4,123.19 152.4,109.22 153.67,106.68 IC18.11 153.67,104.14 152.4,101.6 152.4,87.63 153.67,85.09 IC17.11 153.67,82.55 152.4,80.01 152.4,66.04 153.67,63.5 IC16.11 IC15.18 153.67,53.34 166.37,40.64 J8.9 | Q7.C 71.12,63.5 69.85,60.96 69.85,50.8 71.12,48.26 IC6.7 | IC25.12 187.96,140.97 186.69,138.43 186.69,132.08 187.96,129.54 IC24.12 187.96,124.46 186.69,121.92 186.69,118.11 187.96,115.57 IC23.12 187.96,110.49 186.69,107.95 186.69,104.14 187.96,101.6 IC22.12 | R39.1 168.91,97.79 v168.91,86.36
  Bottom 0.305: 71.12,41.91 55.88,41.91 53.34,40.64 13.97,40.64 J1.1 | IC6.7 71.12,41.91 | 71.12,41.91 73.03,41.91 80.64,57.15 106.68,57.15 123.83,74.3 142.88,74.3 153.67,63.5 IC16.11 | IC20.14 182.88,27.3 | 182.88,27.3 196.85,27.3 211.46,12.7 222.25,12.7 224.79,10.16 IC26.6 | J8.9 166.37,29.21 168.28,27.3 182.88,27.3 | v168.91,86.36 156.21,86.36 153.67,85.09 IC17.11 | R39.1 173.99,102.87 185.42,102.87 IC22.12
EAR1
  Top 0.305: J9.3 187.96,10.16 189.23,11.43 194.31,11.43 195.58,10.16 204.47,10.16 205.74,11.43 205.74,78.11 T1.P$1
EAR2
  Top 0.305: J9.4 205.74,8.89 207.01,10.16 207.01,73.03 T1.P$2
GND  (via drill 0.3 pad 0.3, 0.9 pad 0.3)
  Top 0.305: IC20.6 190.5,24.13 191.77,25.4 194.31,25.4 195.58,24.13 IC20.8 | IC21.8 193.04,73.03 199.39,73.03 199.39,72.39 | R51.2 199.39,82.55 | 199.39,134.62 199.39,120.65
  Top 1.27: IC1.7 49.53,21.59 49.53,123.19 | IC2.8 49.53,46.99 | IC4.7 49.53,123.19 | J1.8 21.59,17.78 | J2.8 21.59,43.18 | J3.8 21.59,68.58 | J2.13 18.41,56.52 22.23,56.52 | J2.14 18.41,57.78 22.23,57.78 21.59,57.15 | 22.23,134.62 22.23,133.99 18.41,133.99 J5.14 | IC8.7 76.2,123.19 | IC6.8 74.93,46.99 | IC5.7 76.2,21.59 | 76.2,21.59 C5.2 | IC13.7 109.22,106.68 | IC12.7 109.22,83.82 | IC11.7 109.22,60.96 | IC10.7 106.68,38.1 | IC9.7 108.58,18.41 108.58,24.13 | 108.58,24.13 108.58,38.1 | IC14.8 109.22,129.54 | IC26.8 233.68,8.89 | IC29.8 232.41,45.72 | IC30.8 233.68,92.71 | IC31.8 233.68,106.68 | IC32.8 232.41,120.65 | J5.8 22.86,119.38 | J4.8 21.59,93.98 | J9.5 199.39,16.51 C9.2 | IC20.8 199.39,22.86 | IC21.7 199.39,64.77 | IC28.6 233.68,36.83 | IC27.6 233.68,27.94 | IC23.8 199.39,106.68 | IC24.8 199.39,120.65 | IC25.8 199.39,134.62 C12.2 | IC22.8 199.39,92.71 | IC33.8 233.68,134.62 | S2.2 234.31,76.2 | C7.2 108.58,24.13 | C6.2 85.09,147.32 | C11.2 199.39,76.2 | J5.13 18.41,132.72 22.23,132.72 | J4.14 18.41,108.58 21.59,108.58 | J4.13 18.41,107.31 21.59,107.31 | S1.2 75.56,63.5 | v49.53,97.79 49.53,100.33 | v76.2,97.79 76.2,99.06 | 49.53,123.19 49.53,148.59 76.2,148.59 76.2,21.59
  Bottom 0.305: IC2.6 41.91,48.26 43.18,49.53 45.72,49.53 46.99,48.26 IC2.8 | IC6.6 68.58,48.26 69.85,49.53 72.39,49.53 73.66,48.26 IC6.8 | IC21.8 193.04,73.03 190.5,73.03 IC21.9 | R48.1 179.07,43.18 177.8,44.45 177.8,59.69 179.07,61.59 191.77,61.59 193.04,62.87 IC21.7 | R51.2 D1.A 215.9,80.01 T1.P$5
  Bottom 1.27: IC3.7 v49.53,97.79 | IC7.7 v76.2,97.79
  other vias: 228.6,3.81
  pour Top (no thermals): 21.59,135.25 21.59,17.14 24.13,17.14 23.5,133.99 26.67,137.16 34.92,137.16 42.55,146.05 48.26,146.05 48.26,17.14 48.9,17.14 50.8,19.05 50.8,146.05 74.93,146.05 74.93,22.86 73.66,20.95 77.47,20.95 77.47,146.05 105.41,146.05 105.41,140.97 107.95,138.43 107.95,49.53 105.41,36.83 109.22,36.83 113.03,49.53 113.03,78.74 116.84,107.95 116.84,133.35 125.73,141.6 125.73,146.05 198.12,146.05 198.12,15.88 199.39,15.88 200.66,17.78 200.66,146.05 232.41,146.05 232.41,6.35 228.6,5.08 arc90 227.33,3.81 arc90 228.6,2.54 232.41,1.27 237.49,1.27 237.49,151.13 120.65,151.13 120.65,143.51 118.11,140.97 113.03,140.97 110.49,143.51 110.49,151.13 49.53,151.13 41.27,148.59 40.64,147.96 40.64,147.32 33.66,139.7 26.04,139.7
  pour Bottom (no thermals): 130.81,40.64 130.18,38.1 105.41,38.1 105.41,36.83 107.95,36.83 108.58,36.2 114.94,36.2 118.11,33.02 132.08,33.02 132.72,31.11 133.99,31.11
MIC
  Top 0.305: J9.6 187.96,19.05 189.23,21.59 189.23,35.56 R46.2 R47.2 | R47.2 C10.1 | R47.2 R48.2
N$1
  Top 0.305: IC10.8 105.41,44.45 104.14,41.91 104.14,35.56 C8.1
  Bottom 0.305: IC10.9 102.87,46.35 105.41,46.35 | IC10.8 105.41,46.35 | 105.41,46.35 106.68,46.99 113.03,46.99 120.65,54.61 127,54.61 IC15.28
N$2
  Top 0.305: IC21.3 IC21.12
  Bottom 0.305: IC21.13 180.34,73.03 182.88,73.03 IC21.12
N$3  (via drill 0.3)
  Top 0.305: C8.2 R22.1 113.67,36.2 v113.67,45.09
  Bottom 0.305: v113.67,45.09 121.92,53.34 129.54,53.34 130.81,54.61 IC15.27
N$4
  Bottom 0.305: IC21.6 190.5,66.04 192.41,67.94 204.47,67.94 207.01,65.41 207.01,36.2 D2.K
N$5
  Top 0.305: IC21.5 187.96,66.04 185.42,71.12 IC21.11
N$6
  Top 0.305: IC21.4 185.42,66.04 184.15,68.58 184.15,81.28 187.96,83.82 R52.1
N$7
  Bottom 1.27: Q3.E Q2.E Q4.E Q5.E Q1.E Q0.E Q6.E Q7.E S1.1
N$8
  Top 0.305: IC13.9 102.87,113.03 100.33,107.95 | 100.33,107.95 IC13.5 | 95.25,113.03 92.71,107.95 IC13.2 92.71,105.41 96.52,97.79 96.52,64.77 95.25,62.23 IC11.3 95.25,53.34 93.98,50.8 93.98,31.75 95.25,29.21 IC9.12 95.25,21.59 | IC13.12 95.25,113.03 | 95.25,113.03 100.33,107.95 | IC9.5 100.33,16.51 | 100.33,16.51 102.87,21.59 IC9.9 | IC9.2 92.71,16.51 95.25,21.59 | 95.25,21.59 100.33,16.51
N$9  (via drill 0.5)
  Top 0.305: IC1.2 30.48,19.05 30.48,15.24 33.02,12.7 44.45,12.7 v49.53,15.24
  Bottom 0.305: v49.53,15.24 55.88,15.24 60.96,20.32 IC5.3
N$10
  Bottom 0.305: IC1.5 41.91,24.13 60.96,24.13 62.23,24.13 63.5,22.86 IC5.4
N$11
  Top 0.305: IC12.4 97.79,86.36 99.06,88.9 99.06,93.98 104.14,104.14 104.14,120.02 100.33,122.56 90.81,122.56 87.63,125.73 IC14.1
N$12
  Top 0.305: IC11.10 IC11.5
  Bottom 0.305: IC11.5 100.33,60.33 102.87,60.33 IC11.6
N$13
  Bottom 0.305: IC1.12 38.1,25.4 62.23,25.4 63.5,25.4 66.04,27.94 IC5.10
N$14  (via drill 0.3)
  Top 0.305: IC14.15 90.17,139.7 87.63,142.24 85.09,142.24 82.55,139.7 82.55,125.09 85.09,114.3 v85.09,64.77
  Bottom 0.305: v85.09,64.77 92.71,64.77 97.79,62.23 IC11.4
N$15
  Top 0.305: IC12.9 102.87,90.17 99.06,86.36 99.06,72.39 97.79,69.85 IC11.11
N$16
  Top 0.305: IC11.1 91.44,63.5 91.44,81.28 IC12.1
  Bottom 0.305: IC12.1 IC12.2 IC12.10
N$17
  Top 0.305: IC12.12 IC12.3
N$18
  Bottom 0.305: IC5.11 63.5,27.94 62.23,26.67 60.96,26.67 43.18,26.67 41.91,27.94 IC1.9
N$19
  Top 0.305: IC8.3 57.15,115.57 57.15,91.44 R14.1
N$20
  Top 0.305: IC8.4 63.5,121.92 62.23,119.38 62.23,91.44 R16.1
N$21
  Bottom 0.305: IC20.11 190.5,31.75 181.61,40.64 R47.1
N$21`
  Top 0.305: IC4.4 36.83,121.92 35.56,119.38 35.56,91.44 R8.1
N$22
  Top 0.305: IC4.3 30.48,115.57 30.48,91.44 R6.1
N$23
  Top 0.305: IC4.11 36.83,129.54 38.1,127 38.1,102.87 40.64,100.33 40.64,91.44 R11.1
N$24
  Top 0.305: IC4.10 39.37,129.54 40.64,127 40.64,120.65 46.99,107.95 R13.1
N$25
  Top 0.305: IC8.11 63.5,129.54 64.77,127 64.77,102.87 67.31,100.33 67.31,91.44 R19.1
N$26
  Top 0.305: IC8.10 66.04,129.54 67.31,127 67.31,120.65 73.66,107.95 R21.1
N$27
  Top 0.305: R17.1 IC7.4
N$28
  Top 0.305: R15.1 59.69,91.44 59.69,95.25 IC7.3
N$29
  Top 0.305: IC3.4 R9.1
N$30
  Top 0.305: IC3.3 33.02,95.25 33.02,91.44 R7.1
N$31
  Top 0.305: IC3.11 36.83,101.6 38.1,100.33 38.1,91.44 R10.1
N$32
  Top 0.305: IC3.10 39.37,104.14 43.18,100.33 43.18,91.44 R12.1
N$33
  Top 0.305: IC7.11 63.5,101.6 64.77,100.33 64.77,91.44 R18.1
N$34
  Top 0.305: R20.1 69.85,91.44 69.85,100.33 66.04,104.14 IC7.10
N$35
  Top 0.305: IC20.1 177.8,24.13 179.07,26.67 179.07,34.92 177.8,37.47 177.8,45.72 R50.1
N$36
  Bottom 0.305: IC28.2 222.25,33.02 220.98,35.56 220.98,38.73 215.9,43.81 215.9,49.53 214.63,52.07 IC29.15
N$37
  Bottom 0.305: IC29.10 227.33,52.07 228.6,49.53 228.6,35.56 229.87,33.02 IC28.5
N$38
  Bottom 0.305: Q9.B 182.88,57.15 184.15,55.88 189.23,55.88 190.5,54.61 R50.2
N$39
  Bottom 0.305: R49.2 189.23,45.72 182.88,52.07 Q8.B
N$40
  Top 0.305: IC28.9 222.25,38.1 220.98,40.64 220.98,49.53 222.25,52.07 IC29.12
N$41
  Top 0.305: IC29.13 219.71,52.07 218.44,49.53 218.44,40.64 219.71,38.1 IC28.10
N$42
  Top 0.305: IC20.2 180.34,24.13 181.61,26.67 181.61,35.56 R46.1
N$43
  Bottom 0.305: R49.1 181.61,45.72 185.42,41.91 185.42,39.37 193.04,31.75 IC20.10
N$44
  Top 0.305: IC28.8 224.79,38.1 223.52,40.64 223.52,49.53 224.79,52.07 IC29.11
N$45
  Top 0.305: IC28.4 227.33,33.02 228.6,35.56 228.6,49.53 229.87,52.07 IC29.9
N$46
  Bottom 0.305: IC28.3 224.79,33.02 223.52,35.56 223.52,38.73 218.44,43.81 218.44,49.53 217.17,52.07 IC29.14
N$47
  Bottom 0.305: IC26.15 214.63,17.78 222.25,21.59 IC27.2
N$48  (via drill 0.3)
  Top 0.305: v227.33,17.78 IC27.5
  Bottom 0.305: IC26.10 v227.33,17.78
N$49
  Top 0.305: IC27.9 222.25,26.67 220.98,24.13 220.98,20.32 222.25,17.78 IC26.12
N$50
  Top 0.305: IC27.10 219.71,26.67 218.44,24.13 218.44,20.32 IC26.13
N$51
  Top 0.305: IC26.11 224.79,17.78 223.52,20.32 223.52,24.13 224.79,26.67 IC27.8
N$52
  Bottom 0.305: IC26.9 229.87,17.78 IC27.4
N$53
  Bottom 0.305: IC26.14 217.17,17.78 224.79,21.59 IC27.3
N$54
  Top 0.305: D3.C D4.C D5.C S2.1
N$55
  Bottom 0.305: R51.1 D1.C 181.61,80.01 186.69,77.47 215.9,77.47 T1.P$3 219.71,72.39 208.28,60.96 208.28,36.83 D2.A
NMI
  Top 0.305: IC15.4 135.89,36.83 134.62,34.29 134.62,26.67 133.35,24.13 J7.2 R25.1
O0
  Top 0.305: IC10.10 IC10.5
  Bottom 0.305: IC10.6 102.87,37.47 100.33,37.47 | IC10.5 100.33,37.47 | 100.33,37.47 100.33,36.83 R22.2 | IC10.11 97.79,46.35 100.33,46.35 IC10.10
OP0
  Bottom 0.305: IC6.2 54.61,43.18 34.29,43.18 31.75,41.91 25.4,41.91 J2.9
OP1
  Bottom 0.305: IC6.1 53.34,44.45 34.29,44.45 31.75,43.18 26.67,43.18 19.05,46.99 12.7,46.99 J2.6
OP2
  Bottom 0.305: IC2.2 31.75,45.72 30.48,44.45 27.94,44.45 20.32,48.26 J2.10
OP3
  Bottom 0.305: IC2.1 24.13,49.53 12.7,49.53 J2.5
OP4
  Bottom 0.305: IC2.11 41.91,55.88 41.27,57.15 27.94,57.15 24.77,50.8 J2.11
OP5
  Bottom 0.305: IC2.10 44.45,55.88 43.18,58.42 26.67,58.42 23.5,52.07 12.7,52.07 J2.4
OP6
  Bottom 0.305: J2.12 22.23,53.34 25.4,59.69 66.67,59.69 68.58,55.88 IC6.11
OP7
  Bottom 0.305: J2.3 12.7,54.61 20.95,54.61 24.13,60.96 68.58,60.96 71.12,55.88 IC6.10
PA0
  Bottom 0.305: IC8.5 66.04,121.92 62.23,118.11 25.4,118.11 23.5,121.92 J5.9
PA1
  Bottom 0.305: IC8.1 55.88,121.92 53.34,119.38 26.67,119.38 24.77,123.19 12.7,123.19 J5.6
PA2
  Bottom 0.305: IC4.5 39.37,121.92 38.1,120.65 27.94,120.65 26.04,124.46 J5.10
PA3
  Bottom 0.305: IC4.1 29.21,124.46 28.57,125.73 12.7,125.73 J5.5
PA4
  Bottom 0.305: IC4.13 31.75,129.54 30.48,127 J5.11
PA5
  Bottom 0.305: IC4.9 41.91,132.08 40.64,133.35 26.67,133.35 24.13,128.27 12.7,128.27 J5.4
PA6
  Bottom 0.305: IC8.13 58.42,132.08 57.15,133.35 43.18,133.35 41.91,134.62 25.4,134.62 22.86,129.54 J5.12
PA7
  Bottom 0.305: IC8.9 68.58,132.08 66.04,134.62 44.45,134.62 43.18,135.89 24.13,135.89 21.59,130.81 12.7,130.81 J5.3
PB0
  Bottom 0.305: J4.9 24.13,96.52 26.04,92.71 62.23,92.71 66.04,96.52 IC7.5
PB1
  Bottom 0.305: J4.6 12.7,97.79 25.4,97.79 27.3,93.98 53.34,93.98 55.88,96.52 IC7.1
PB2
  Bottom 0.305: IC3.5 39.37,96.52 38.1,95.25 27.94,95.25 26.04,99.06 J4.10
PB3
  Bottom 0.305: IC3.1 29.21,99.06 28.57,100.33 12.7,100.33 J4.5
PB4
  Bottom 0.305: IC3.13 31.75,104.14 30.48,101.6 J4.11
PB5
  Bottom 0.305: J4.4 12.7,102.87 24.13,102.87 26.67,107.95 40.64,107.95 41.91,106.68 IC3.9
PB6
  Bottom 0.305: IC7.13 58.42,106.68 57.15,107.95 43.18,107.95 41.91,109.22 25.4,109.22 22.86,104.14 J4.12
PB7
  Bottom 0.305: IC7.9 68.58,106.68 66.04,109.22 44.45,109.22 43.18,110.49 24.13,110.49 21.59,105.41 12.7,105.41 J4.3
R/W
  Bottom 0.305: IC15.26 133.35,54.61 130.81,52.07 123.19,52.07 114.3,43.18 96.52,43.18 95.25,44.45 IC10.12
RAM_CS0  (via drill 0.3, 0.6)
  Top 0.305: v165.1,134.62 v165.1,98.42
  Bottom 0.305: IC22.13 185.42,97.79 | 185.42,97.79 175.26,97.79 173.99,98.42 v165.1,98.42 | 185.42,97.79 218.44,97.79 219.71,99.06 IC30.13 | IC14.12 97.79,135.89 101.6,132.08 116.84,132.08 118.11,130.81 124.46,130.81 129.54,133.35 156.84,133.35 160.02,134.62 v165.1,134.62
RAM_CS1  (via drill 0.3)
  Top 0.305: v166.37,135.89 v166.37,112.39
  Bottom 0.305: IC31.13 219.71,113.03 218.44,111.76 185.42,111.76 | 185.42,111.76 176.53,111.76 173.99,112.39 v166.37,112.39 | IC23.13 185.42,111.76 | IC14.11 100.33,135.89 102.87,133.35 118.11,133.35 119.38,132.08 124.46,132.08 129.54,134.62 156.21,134.62 158.75,135.89 v166.37,135.89
RAM_CS2  (via drill 0.3)
  Top 0.305: v167.64,137.16 v167.64,126.36
  Bottom 0.305: IC14.10 102.87,135.89 104.14,134.62 118.75,134.62 120.02,133.35 124.46,133.35 129.54,135.89 155.57,135.89 158.75,137.16 v167.64,137.16 | v167.64,126.36 173.99,126.36 175.26,125.73 185.42,125.73 | 185.42,125.73 218.44,125.73 219.71,127 IC32.13 | IC24.13 185.42,125.73
RAM_CS3
  Bottom 0.305: IC33.13 219.71,140.97 218.44,139.7 185.42,139.7 | 185.42,139.7 176.53,139.7 173.99,140.97 160.66,140.97 153.03,137.16 128.91,137.16 123.83,134.62 120.65,134.62 119.38,135.89 105.41,135.89 IC14.9 | IC25.13 185.42,139.7
RAM_RW  (via drill 0.3 pad 0.3)
  Top 0.305: IC25.14 182.88,140.97 181.61,138.43 181.61,132.08 182.88,129.54 IC24.14 182.88,124.46 181.61,121.92 181.61,118.11 182.88,115.57 IC23.14 182.88,110.49 181.61,107.95 181.61,104.14 182.88,101.6 IC22.14 182.88,96.52 181.61,93.98 v181.61,90.17 | IC33.14 217.17,140.97 215.9,138.43 215.9,132.08 217.17,129.54 IC32.14 217.17,124.46 215.9,121.92 215.9,118.11 217.17,115.57 IC31.14 217.17,110.49 215.9,107.95 215.9,104.14 217.17,101.6 IC30.14 217.17,96.52 215.9,93.98 v215.9,90.17 | v116.84,90.17 v116.84,40.64
  Bottom 0.305: J7.10 140.97,29.21 138.43,26.67 99.06,26.67 90.17,35.56 IC10.1 90.17,39.37 91.44,40.64 v116.84,40.64 | v116.84,90.17 v181.61,90.17 v215.9,90.17
RELAY1
  Top 0.305: J9.7 185.42,19.05 186.69,21.59 186.69,48.26 187.96,50.8 187.96,55.88 Q9.C
RELAY2
  Top 0.305: J9.8 182.88,19.05 184.15,21.59 184.15,48.26 185.42,50.8 Q8.C
ROM_CS0  (via drill 0.3)
  Top 0.305: v120.65,122.56 120.65,113.03 121.92,110.49 121.92,91.44 123.19,88.9 v123.19,81.28
  Bottom 0.305: IC14.4 95.25,128.91 101.6,122.56 v120.65,122.56 | v123.19,81.28 150.5,81.28 153.67,78.74 IC16.14
ROM_CS1  (via drill 0.3)
  Top 0.305: v121.92,123.83 121.92,113.03 123.19,110.49 v123.19,92.71 | v153.67,92.71 IC17.14
  Bottom 0.305: IC14.5 97.79,128.91 102.87,123.83 v121.92,123.83 | v123.19,92.71 v153.67,92.71
ROM_CS2  (via drill 0.3, 0.3 pad 0.3)
  Top 0.305: v123.19,125.09 v123.19,113.03 | v153.67,113.03 IC18.14
  Bottom 0.305: IC14.6 100.33,128.91 104.14,125.09 v123.19,125.09 | v123.19,113.03 v153.67,113.03
ROM_CS3  (via drill 0.3)
  Top 0.305: v123.19,126.36 v123.19,135.89
  Bottom 0.305: IC14.7 102.87,128.91 105.41,126.36 v123.19,126.36 | IC19.14 153.67,140.97 148.59,138.43 128.27,138.43 v123.19,135.89
TB0
  Top 0.305: Q0.B 62.23,67.31 63.5,68.58 R17.2
  Bottom 0.305: R17.2 R16.2 57.15,85.09 24.13,85.09 19.05,82.55 12.7,82.55 J3.2
TB1
  Top 0.305: Q1.B 57.15,67.31 58.42,68.58 R15.2
  Bottom 0.305: R15.2 R14.2 53.34,83.82 25.4,83.82 20.32,81.28 J3.13
TB2
  Top 0.305: Q2.B 35.56,67.31 36.83,68.58 R9.2
  Bottom 0.305: R9.2 R8.2 33.66,80.01 26.67,80.01 21.59,77.47 12.7,77.47 J3.4
TB3
  Top 0.305: Q3.B 30.48,67.31 31.75,68.58 R7.2
  Bottom 0.305: R7.2 R6.2 26.67,78.74 21.59,76.2 J3.11
TB4
  Top 0.305: Q4.B 40.64,67.31 41.91,68.58 R11.2
  Bottom 0.305: R11.2 R10.2 38.1,81.28 26.67,81.28 21.59,78.74 J3.12
TB5
  Top 0.305: Q5.B 45.72,67.31 46.99,68.58 R13.2
  Bottom 0.305: R13.2 R12.2 42.55,82.55 26.67,82.55 21.59,80.01 12.7,80.01 J3.3
TB6
  Top 0.305: Q6.B 67.31,67.31 68.58,68.58 R19.2
  Bottom 0.305: R19.2 R18.2 62.23,86.36 22.23,86.36 J3.14
TB7
  Top 0.305: R21.2 73.66,68.58 72.39,67.31 Q7.B
  Bottom 0.305: R21.2 R20.2 66.67,87.63 17.78,87.63 J3.1 | Q7.B 80.01,67.31 87.63,74.93 116.84,74.93 123.83,88.9 176.53,88.9 R52.2
Θ2
  Bottom 0.305: J7.12 135.89,29.21 134.62,27.94 102.23,27.94 97.79,36.83 IC10.4
Θ2_RW  (via drill 0.5)
  Top 0.305: IC1.4 36.83,22.86 39.37,27.94 IC1.10 | IC1.13 31.75,27.94 29.21,22.86 IC1.1 29.21,13.97 31.75,11.43 46.99,11.43 v49.53,12.7 | IC10.13 IC10.2
  Bottom 0.305: v49.53,12.7 60.96,12.7 64.77,16.51 R5.2 64.77,24.13 67.31,26.67 73.66,26.67 IC10.13 | IC1.13 31.75,27.94 36.83,22.86 IC1.4 | 95.25,37.47 95.25,36.83 100.33,27.3 136.53,27.3 138.43,29.21 J7.11 138.43,31.75 142.24,35.56 175.26,35.56 176.53,36.83 176.53,41.91 175.26,43.18 175.26,58.42 177.8,63.5 IC21.1 | IC10.2 92.71,37.47 95.25,37.47 | 95.25,37.47 IC10.3

## Text on the board
Top: PAiA | 8700
tNames: PIEBUG | 6503 | EXPANSION